# Altium schematic sheet DB31_Hardware_Kit.SchDoc: DB31 Hardware Kit
size A4; Organization: Altium Limited.; Address1: Level 3, 12a Rodborough Rd; Address2: Frenchs Forest 2086; Address3: NSW; Address4: AUSTRALIA; SheetNumber: 8; SheetTotal: 21
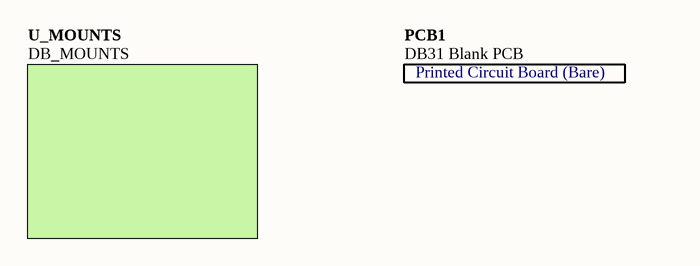
[diagram p0: DB31_Hardware_Kit.SchDoc]

## Parts
PCB1  DB31 Blank PCB  (mechanical)

## Sub-sheets
U_MOUNTS = DB_MOUNTS: no entries

## Notes on the sheet
- Sheet Title
- Project Title
- Size:
- Date:
- A4
- Assy:
- Time:
- Revision:
- Sheet
- of
- File:
- (in symbol D-810-0005) Printed Circuit Board (Bare)

## Library data of the parts
PCB1 = D-810-0005: DB31 Blank PCB - Daughter Board Altera Cyclone2 EP2C35F672C8; ProjectPath: DB31.PrjPCB; Status: Unreleased; Category: Blank PCB